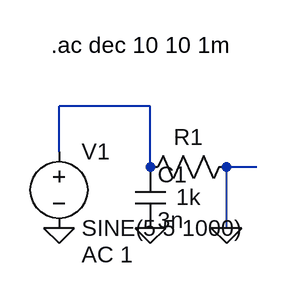
[diagram p0: schematic Draft1.asc]
Draft1.asc, the LTspice schematic file:
Version 4
SHEET 1 880 680
WIRE 96 112 0 112
WIRE 0 160 0 112
WIRE 96 176 96 112
WIRE 208 176 176 176
WIRE 176 240 176 176
FLAG 96 240 0
FLAG 0 240 0
FLAG 176 240 0
SYMBOL cap 80 176 R0
SYMATTR InstName C1
SYMATTR Value 3n
SYMBOL res 192 160 R90
WINDOW 0 0 56 VBottom 2
WINDOW 3 32 56 VTop 2
SYMATTR InstName R1
SYMATTR Value 1k
SYMBOL voltage 0 144 R0
WINDOW 123 24 124 Left 2
WINDOW 39 0 0 Left 0
SYMATTR InstName V1
SYMATTR Value SINE(5 5 1000)
SYMATTR Value2 AC 1
TEXT -8 48 Left 2 !.ac dec 10 10 1m

The netlist it stands for:
* Draft1.asc
C1 N001 0 3n
R1 0 N001 1k
V1 N001 0 SINE(5 5 1000) AC 1
.ac dec 10 10 1m
.backanno
.end